# EasyEDA Pro project ProDoc_RiscArchive_PCB.epro

# Board SUBRlogo_CH32V003EasyUSBBoard_PCB_2
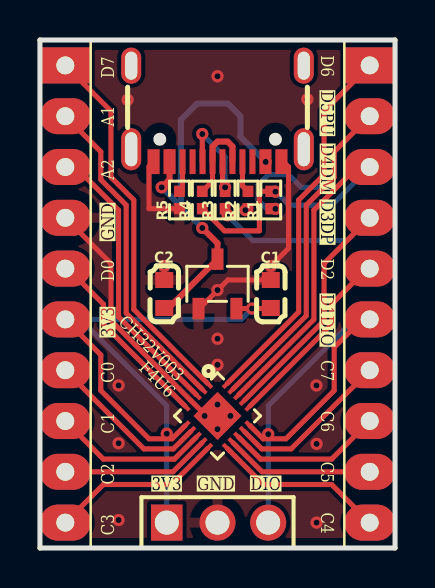
[diagram p0: board, top side]
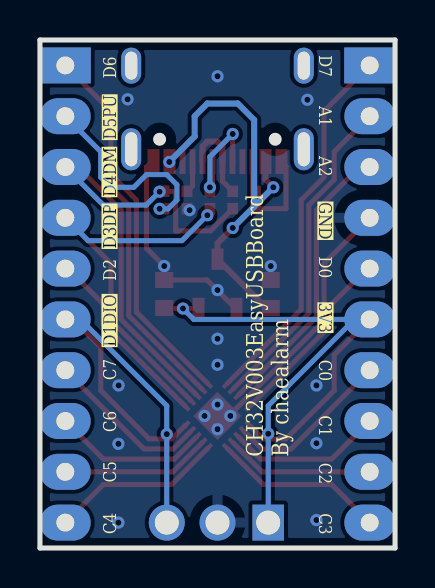
[diagram p1: board, bottom side, seen from below]

Outline 17.78 x 25.4 mm; copper layers: Top Layer, Bottom Layer. Coordinates in mm from the lower left corner of the outline.
Outline path: 0,25.4 17.78,25.4 17.78,0 0,0 0,25.4
Stack: Top Layer 0.035mm / Dielectric1 1.51mm FR4 er 4.5 / Bottom Layer 0.035mm

## Design rules (mm)
template: JLCPCB Capability(Two Layers Board)
spacing copperThickness1oz (default): track to track 0.102, other pairs 0.152 to 0.3
spacing copperThickness2oz: track to track 0.203, other pairs 0.152 to 0.3
track width copperThickness1oz (default): min 0.127, default 0.254, max 2.54
track width copperThickness2oz: min 0.203, default 0.254, max 2.54
differential pair differentialPair (default): width min 0.127, default 0.254, max 2.54; gap min 0.152, default 0.152
via viaSize (default): diameter min 0.5, default 0.61, max 10; hole min 0.3, default 0.305, max 6.3

## Placement (name value [footprint] x y rotation side)
C1  10uF  [C0603]  11.56 12.7 270 top
C2  10uF  [C0603]  6.22 12.7 270 top
H1  2.54X10 MALE HEADER  [footprint_8cc6]  1.27 8.89 270 top
H2  2.54X10 MALE HEADER  [footprint_8cc6]  16.51 8.89 270 top
H3  DS1002-01-1X3V13-JK  [footprint_da6f]  8.89 1.27 0 top
R1  1.5kΩ  [R0402]  11.56 17.4 90 top
R2  5.1kΩ  [R0402]  10.41 17.4 90 top
R3  33Ω  [R0402]  9.27 17.4 90 top
R4  33Ω  [R0402]  8.13 17.4 90 top
R5  5.1kΩ  [R0402]  6.99 17.4 90 top
U1  CH32V003F4U6  [QFN-20_L3.0-W3.0-P0.40-TL-EP1.7]  8.89 6.6 315 top
U2  XC6206P332MR-G  [SOT-23-3_L2.9-W1.6-P1.90-LS2.8-BR]  8.89 13.21 270 top
USB1  GT-USB-7010ASV  [USB-C-SMD_G-SWITCH_GT-USB-7010ASV]  8.89 21.72 180 top

## Footprints (pads in the part's own frame, mm; a bottom-side part is the same pattern mirrored in y, then rotated)
C0603
  rect 0.8x0.9 smd: 1(-0.7,0) 2(0.7,0)
footprint_8cc6
  rect 1.8x2.54 hole 0.889x0.894: 1(-15.24,0)
  oval 1.8x2.54 hole 0.889x0.894: 2(-12.7,0) 3(-10.16,0) 4(-7.62,0) 5(-5.08,0) 6(-2.54,0) 7(0,0) 8(2.54,0) 9(5.08,0) 10(7.62,0)
footprint_da6f
  rect 1.575x1.8 hole 1.2: 1(-2.54,0)
  round 1.8 hole 1.2: 2(0,0) 3(2.54,0)
QFN-20_L3.0-W3.0-P0.40-TL-EP1.7
  rect 0.6x0.2 smd: 1(-1.5,0.8) 2(-1.5,0.401) 3(-1.5,0) 4(-1.5,-0.4) 5(-1.5,-0.8) 11(1.5,-0.8) 12(1.5,-0.4) 13(1.5,0) 14(1.5,0.401) 15(1.5,0.8)
  rect 0.2x0.6 smd: 6(-0.8,-1.5) 7(-0.4,-1.5) 8(0,-1.5) 9(0.4,-1.5) 10(0.799,-1.5) 16(0.8,1.5) 17(0.4,1.5) 18(0,1.5) 19(-0.4,1.5) 20(-0.8,1.5)
  rect 1.7x1.7 smd: 21(0,0)
R0402
  rect 0.566x0.54 smd: 1(-0.433,0) 2(0.433,0)
SOT-23-3_L2.9-W1.6-P1.90-LS2.8-BR
  rect 1.07x0.6 smd: 1(1.235,-0.95) 2(1.235,0.95) 3(-1.235,0)
USB-C-SMD_G-SWITCH_GT-USB-7010ASV
  oval 1x2.1 hole 0.6x1.7: 1(-4.32,1.78) 2(4.32,1.78)
  oval 1x1.8 hole 0.6x1.4: 3(4.32,-2.4) 4(-4.32,-2.4)
  rect 0.6x1.24 smd: A1B12(-3.2,2.4) A4B9(-2.4,2.4) B1A12(3.2,2.4) B4A9(2.4,2.4)
  rect 0.3x1.24 smd: A5(-1.25,2.4) A6(-0.25,2.4) A7(0.25,2.4) A8(1.25,2.4) B5(1.75,2.4) B6(0.75,2.4) B7(-0.75,2.4) B8(-1.75,2.4)

## Nets
+3V3: C1.2 H1.6 H3.1 U1.6 U2.2
+5V: C2.2 U2.3 USB1.A4B9 USB1.B4A9
GND: C1.1 C2.1 H1.4 H3.2 R2.1 R5.1 U1.4 U1.21 U2.1 USB1.A1B12 USB1.B1A12
DIO: H2.6 H3.3 U1.15
DPU: H2.2 R1.1 U1.19
PA1: H1.2 U1.2
PA2: H1.3 U1.3
PC0: H1.7 U1.7
PC1: H1.8 U1.8
PC2: H1.9 U1.9
PC3: H1.10 U1.10
PC4: H2.10 U1.11
PC5: H2.9 U1.12
PC6: H2.8 U1.13
PC7: H2.7 U1.14
PD0: H1.5 U1.5
PD2: H2.5 U1.16
PD6: H2.1 U1.20
PD7: H1.1 U1.1
UDM: H2.3 R1.2 R4.1 U1.18
UDP: H2.4 R3.1 U1.17
$1N1999: R2.2 USB1.A5
$1N2038: R5.2 USB1.B5
$1N2259: R3.2 USB1.A6 USB1.B6
$1N2270: R4.2 USB1.A7 USB1.B7

Pads without a net: USB1 1 2 3 4 A8 B8

## Via types
v1: diameter 0.61, hole 0.305, Top Layer to Bottom Layer, 30 vias

## Routing (per net, layer and track width the routed paths; a pad name or vN(x,y) marks a point on that pad's centre or on a via; arc(x,y) is an arc through that point)
+3V3: length 33
  Top Layer w0.254: U2.2 v1(10.62,11.97) 11.53,11.97 C1.2 ; U1.6 6.62,5.46 5.46,5.46 3.05,7.87 3.05,9.65 H1.6
  Bottom Layer w0.254: v1(10.62,11.97) 10.08,11.43 2.03,11.43 ; 2.03,11.43 H1.6 ; 2.03,11.43 6.35,7.11 v1(6.35,5.72) H3.1
+5V: length 21.1
  Top Layer w0.254: 6.49,19.83 USB1.B4A9
  Top Layer w0.3: v1(8.13,16) 8.89,15.24 U2.3 6.57,12.13 6.22,12.13 ; USB1.B4A9 6.49,18.43 v1(6.1,18.03)
  Bottom Layer w0.3: 7.05,17.08 v1(6.1,18.03) ; 7.05,17.08 7.05,21.4 7.87,22.23 9.4,22.23 10.03,21.59 10.03,20.57 v1(11.3,19.3) ; 7.05,17.08 v1(8.13,16)
GND: length 27.8
  Top Layer w0.254: H1.4 3.56,14.22 3.56,11.37 7.55,7.38 8.32,6.6 8.89,6.6 ; C1.1 9.41,13.4 7.98,11.97 7.94,11.97 ; USB1.B1A12 5.46,19.09 5.46,16.97 7.11,16.97 ; 12.06,19.43 12.09,19.41 ; 12.09,19.41 USB1.A1B12 ; 12.09,19.41 12.45,19.05 12.45,14.99 v1(11.56,14.1) ; v1(10.29,16.89) 10.34,16.89 10.41,16.97
  vias: v1(3.94,8.13) v1(3.94,5.24) v1(3.94,1.4) v1(4.39,22.41) v1(6.22,14.1) v1(8.25,6.6) v1(8.89,23.59) v1(8.89,12.9) v1(8.89,10.46) v1(8.89,9.16) v1(8.89,7.17) v1(8.89,5.94) v1(9.54,6.6) v1(13.39,22.43) v1(13.84,8.13) v1(13.85,5.21) v1(13.85,1.27)
DIO: length 22.7
  Top Layer w0.254: H2.6 16.13,11.43 14.73,10.03 14.73,7.87 12.32,5.46 11.18,5.46 10.53,6.11 U1.15
  Bottom Layer w0.254: H2.6 15.75,11.43 11.43,7.11 v1(11.43,5.69) H3.3
DPU: length 26.6
  Top Layer w0.254: U1.19 13.34,11.61 13.34,17.15 14.73,18.54 14.73,19.81 H2.2
  Bottom Layer w0.254: v1(11.79,16.96) 11.36,16.96 10.92,17.4 10.92,18.16 11.43,18.67 12.45,18.67 13.08,18.03 14.22,18.03 14.73,18.54 14.73,19.81 H2.2
PA1: length 16.5
  Top Layer w0.254: H1.2 3.05,19.81 3.05,18.42 4.32,17.15 4.32,11.74 U1.2
PA2: length 14.4
  Top Layer w0.254: H1.3 1.78,19.05 3.94,16.89 3.94,11.56 U1.3
PC0: length 8.3
  Top Layer w0.254: U1.7 6.67,4.95 5.21,4.95 H1.7
PC1: length 7.8
  Top Layer w0.254: 1.27,6.35 3.18,4.45 6.73,4.45 U1.8
PC2: length 7.4
  Top Layer w0.254: H1.9 6.66,3.81 U1.9
PC3: length 8.7
  Top Layer w0.254: U1.10 6.59,3.17 3.18,3.17 1.27,1.27
PC4: length 8.7
  Top Layer w0.254: 16.51,1.27 14.61,3.17 11.19,3.17 9.38,4.98
PC5: length 7.4
  Top Layer w0.254: U1.12 11.12,3.81 H2.9
PC6: length 7.8
  Top Layer w0.254: 16.51,6.35 14.61,4.45 11.05,4.45 U1.13
PC7: length 8.3
  Top Layer w0.254: H2.7 12.57,4.95 11.11,4.95 U1.14
PD0: length 9.4
  Top Layer w0.254: H1.5 1.4,13.97 3.18,12.19 3.18,11.19 U1.5
PD2: length 9.4
  Top Layer w0.254: U1.16 14.61,11.19 14.61,12.19 16.38,13.97 H2.5
PD6: length 18.9
  Top Layer w0.254: U1.20 12.95,11.8 12.95,17.4 14.22,18.67 14.22,21.84 16.51,24.13
PD7: length 18.9
  Top Layer w0.254: U1.1 4.7,11.93 4.7,17.4 3.56,18.54 3.56,21.84 1.27,24.13
UDM: length 26.1
  Top Layer w0.254: R1.2 10.99,17.83 10.99,15.86 9.24,15.86 8.13,16.97 ; H2.3 15.88,19.05 13.72,16.89 13.72,11.43 U1.18
  Bottom Layer w0.254: v1(11.79,17.82) 12.46,17.15 14.61,17.15 H2.3
UDP: length 19.8
  Top Layer w0.254: H2.4 14.22,14.22 14.22,11.37 10.23,7.38
  Bottom Layer w0.254: H2.4 15.37,15.37 10.67,15.37 v1(9.4,16.64)
$1N1999: length 1.6
  Top Layer w0.254: R2.2 10.14,18.11 USB1.A5
$1N2038: length 1.5
  Top Layer w0.254: 7.11,17.83 7.14,17.86 USB1.B5
$1N2259: length 6.1
  Top Layer w0.254: v1(8.13,20.7) 8.13,19.33 USB1.B6 ; R3.2 9.14,17.96 USB1.A6
  Bottom Layer w0.254: v1(9.27,18.03) 9.27,19.56 v1(8.13,20.7)
$1N2270: length 4.4
  Top Layer w0.254: R4.2 8.64,18.34 USB1.A7
  Top Layer w0.3: USB1.A7 8.64,20.07 8.89,20.32 9.4,20.32 9.64,20.08 USB1.B7

## Copper pours and planes (outline as drawn; the poured copper is in the pictures)
GND on Top Layer: -0.76,26.04 18.29,26.04 18.29,-0.63 -0.76,-0.63
GND on Bottom Layer: -1.65,26.67 18.92,26.67 18.92,-1.52 -1.65,-1.52

## Text on the board
Bottom Silkscreen Layer: C3 | D7 | A1 | A2 | GND | D0 | 3V3 | C0 | C1 | C2 | D6 | D5PU | D4DM | D3DP | D2 | D1DIO | C7 | C6 | C5 | C4 | By chaealarm | CH32V003EasyUSBBoard
Top Silkscreen Layer: CH32V003 | F4U6 | D7 | A1 | A2 | GND | D0 | 3V3 | C0 | C1 | C2 | D6 | D5PU | D4DM | D3DP | D2 | D1DIO | C7 | C6 | C5 | C4 | DIO | C3
